# Altium schematic sheet lighthouse_sensor.SchDoc: Vive Lighthouse Sensor
size B; PageSetup: Record=PageOptions|CenterHorizontal=True|CenterVertical=True|PrintScale=0.25|XCorrection=1.00|YCorrection=1.00|PrintKind=0|BorderSize=5000000|LeftOffset=0|BottomOffset=0|Orientation=2|PaperLength=1000|PaperWidth=1000|Scale=100|PaperSource=7|PrintQuality=-3|MediaType=1|DitherType=10|PrintScaleMode=1|PaperKind=Letter|PaperIndex=1
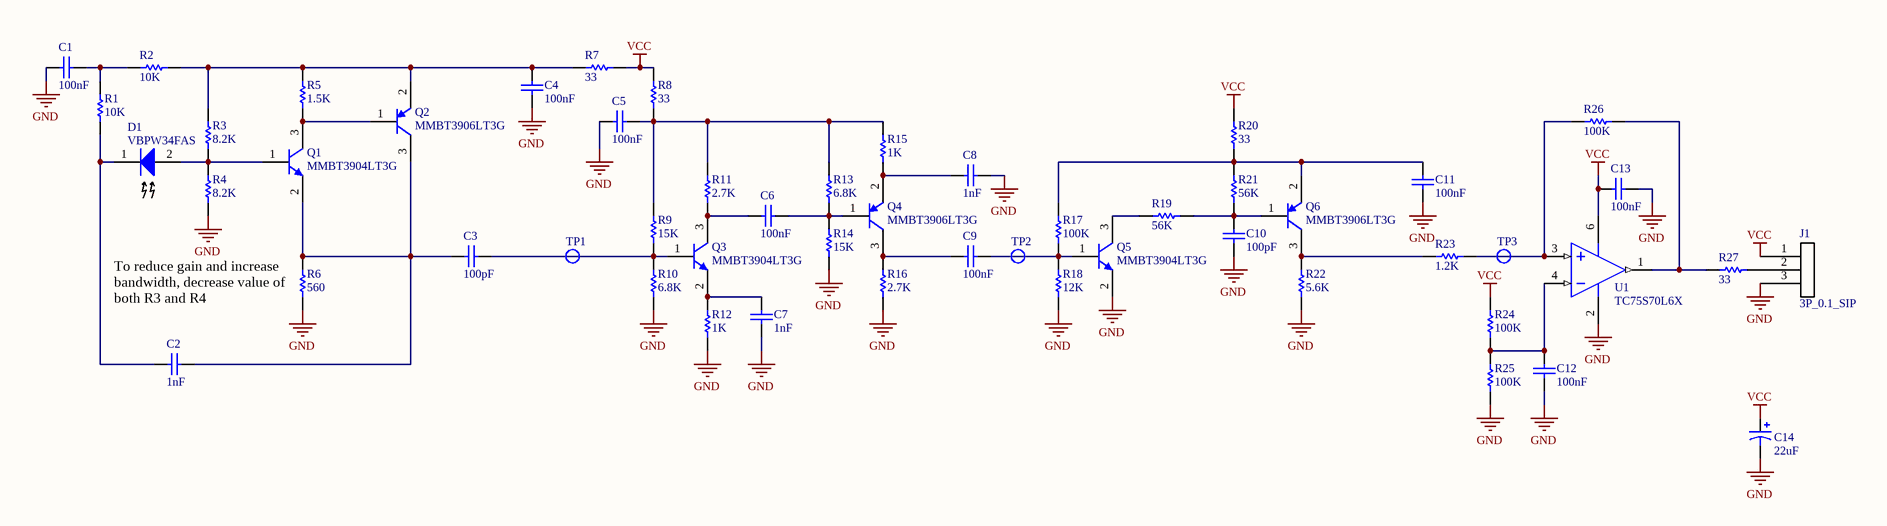
[diagram p0: lighthouse_sensor.SchDoc]

## Parts
C1  value 100nF  [0603]  (hidden comment: C0603)
C2  value 1nF  [0603]  (hidden comment: C0603)
C3  value 100pF  [0603]  (hidden comment: C0603)
C4  value 100nF  [0603]  (hidden comment: C0603)
C5  value 100nF  [0603]  (hidden comment: C0603)
C6  value 100nF  [0603]  (hidden comment: C0603)
C7  value 1nF  [0603]  (hidden comment: C0603)
C8  value 1nF  [0603]  (hidden comment: C0603)
C9  value 100nF  [0603]  (hidden comment: C0603)
C10  value 100pF  [0603]  (hidden comment: C0603)
C11  value 100nF  [0603]  (hidden comment: C0603)
C12  value 100nF  [0603]  (hidden comment: C0603)
C13  value 100nF  [0603]  (hidden comment: C0603)
C14  value 22uF  [Capacitor]  (hidden comment: Electrolytic Capacitor)
D1  VBPW34FAS  [VBPW34FAS]
J1  3P_0.1_SIP  [3P_0.1_SIP]
Q1  MMBT3904LT3G  [ONSC-SOT-23-3-318-08_V]
Q2  MMBT3906LT3G  [ONSC-SOT-23-3-318-08_V]
Q3  MMBT3904LT3G  [ONSC-SOT-23-3-318-08_V]
Q4  MMBT3906LT3G  [ONSC-SOT-23-3-318-08_V]
Q5  MMBT3904LT3G  [ONSC-SOT-23-3-318-08_V]
Q6  MMBT3906LT3G  [ONSC-SOT-23-3-318-08_V]
R1  10K  [3-0603]
R2  10K  [3-0603]
R3  8.2K  [3-0603]
R4  8.2K  [3-0603]
R5  1.5K  [3-0603]
R6  560  [3-0603]
R7  33  [3-0603]
R8  33  [3-0603]
R9  15K  [3-0603]
R10  6.8K  [3-0603]
R11  2.7K  [3-0603]
R12  1K  [3-0603]
R13  6.8K  [3-0603]
R14  15K  [3-0603]
R15  1K  [3-0603]
R16  2.7K  [3-0603]
R17  100K  [3-0603]
R18  12K  [3-0603]
R19  56K  [3-0603]
R20  33  [3-0603]
R21  56K  [3-0603]
R22  5.6K  [3-0603]
R23  1.2K  [3-0603]
R24  100K  [3-0603]
R25  100K  [3-0603]
R26  100K  [3-0603]
R27  33  [3-0603]
U1  TC75S70L6X  [MP6C]

## Nets
GND: C1.2 C4.2 C5.2 C7.2 C8.1 C10.2 C11.2 C12.2 C13.1 C14.2 J1.3 Q5.2(E) R4.1 R6.1 R10.1 R12.1 R14.1 R16.1 R18.1 R22.1 R25.1 U1.2(VSS)
VCC: C13.2 C14.1 J1.1 R7.1 R8.1 R20.1 R24.1 U1.6(VDD)
NetC1_1: C1.1 R1.2 R2.2
NetC2_1: C2.1 C3.2 Q1.2(E) Q2.3(C) R6.2
NetC2_2: C2.2 D1.1(K) R1.1
NetC3_1: C3.1 Q3.1(B) R9.2 R10.2
NetC4_1: C4.1 Q2.2(E) R2.1 R3.2 R5.2 R7.2
NetC5_1: C5.1 R8.2 R9.1 R11.1 R13.1 R15.1
NetC6_1: C6.1 Q4.1(B) R13.2 R14.2
NetC6_2: C6.2 Q3.3(C) R11.2
NetC7_1: C7.1 Q3.2(E) R12.2
NetC8_2: C8.2 Q4.2(E) R15.2
NetC9_1: C9.1 Q5.1(B) R17.2 R18.2
NetC9_2: C9.2 Q4.3(C) R16.2
NetC10_1: C10.1 Q6.1(B) R19.2 R21.2
NetC11_1: C11.1 Q6.2(E) R17.1 R20.2 R21.1
NetC12_1: C12.1 R24.2 R25.2 U1.4(-IN)
NetD1_2: D1.2(A) Q1.1(B) R3.1 R4.2
NetJ1_2: J1.2 R27.1
NetQ1_3: Q1.3(C) Q2.1(B) R5.1
NetQ5_3: Q5.3(C) R19.1
NetQ6_3: Q6.3(C) R22.2 R23.2
NetR23_1: R23.1 R26.2 U1.3(+IN)
NetR26_1: R26.1 R27.2 U1.1(OUT)

## Notes on the sheet
- TP1
- TP2
- (near R23) TP3
- (near R6) To reduce gain and increase bandwidth, decrease value of both R3 and R4

## Library data of the parts
C1-C13 = C0603: Ceramic Chip Capacitor - Standard; Note: Footprint corresponds to dimensions for bulk cassette packaging. This case size has tightened tolerances.; Published: 17-Jul-2002; LatestRevisionDate: 19-Mar-2004; LatestRevisionNote: Silkscreen size reduced.; DatasheetDocument: Mar-2001; PackageDocument: Mar-2001; PackageReference: 0603; Publisher: Altium Limited; Code_JEITA: 0603; Code_IPC: 1608 [0603]; ComponentLink1Description: Manufacturer Link; ComponentLink1URL: http://www.kemet.com/; ComponentLink2Description: Datasheet; ComponentLink2URL: http://www.kemet.com/kemet/web/homepage/kechome.nsf/vapubfilesname/F3102TA.pdf/$file/F3102TA.pdf
D1 = VBPW34FAS: Silicon PIN Photodiode
J1 = 3P_0.1_SIP: 1x3 0.1" PTH Header
Q1 Q3 Q5 = MMBT3904LT3G: General Purpose Transistor, NPN Silicon, 3-Pin SOT-23, Pb-Free, Tape and Reel; Manufacturer: On Semiconductor; fT Min (MHz): 300; IC Continuous (A): 0.2; DatasheetVersion: Rev. 12; PackageVersion: Rev. AP, 11/2009; PackageReference: SOT-23-3-318-08; PackageDescription: 3-Pin Small Outline Transistor, Body 2.92 x 1.3 mm, Pitch 0.95 mm; Supplier 1: Digi-Key; Supplier Part Number 1: MMBT3904LT3GOSTR-ND; Supplier 2: Digi-Key; Supplier Part Number 2: MMBT3904LT3GOSCT-ND; Supplier 3: Digi-Key; Supplier Part Number 3: MMBT3904LT3GOSDKR-ND; Supplier 4: Farnell; Supplier Part Number 4: 1287979; Supplier 5: Newark; Supplier Part Number 5: 98H0751; Supplier 6: Mouser; Supplier Part Number 6: 863-MMBT3904LT3G; Packing: Tape and Reel; Polarity: NPN; RoHS: TRUE; Mounting Technology: Surface Mount; PartNumber: MMBT3904LT3G; ComponentLink1Description: Manufacturer URL; ComponentLink1URL: http://www.onsemi.com/; ComponentLink2Description: Datasheet; ComponentLink2URL: http://www.onsemi.cn/pub_link/Collateral/MMBT3904LT1-D.PDF; ComponentLink3Description: Package Specification; ComponentLink3URL: http://www.onsemi.cn/pub_link/Collateral/318-08.PDF
Q2 Q4 Q6 = MMBT3906LT3G: General Purpose Transistor, PNP Silicon, 3-Pin SOT-23, Pb-Free, Tape and Reel; Manufacturer: On Semiconductor; fT Min (MHz): 250; IC Continuous (A): -0.2; DatasheetVersion: Rev. 11; PackageVersion: Rev. AP, 11/2009; PackageReference: SOT-23-3-318-08; PackageDescription: 3-Pin Small Outline Transistor, Body 2.92 x 1.3 mm, Pitch 0.95 mm; Supplier 1: Digi-Key; Supplier Part Number 1: MMBT3906LT3GOSTR-ND; Supplier 2: Digi-Key; Supplier Part Number 2: MMBT3906LT3GOSCT-ND; Supplier 3: Digi-Key; Supplier Part Number 3: MMBT3906LT3GOSDKR-ND; Supplier 4: Farnell; Supplier Part Number 4: 1887082; Supplier 5: Farnell; Supplier Part Number 5: 2372923; Supplier 6: Newark; Supplier Part Number 6: 98H0752; Supplier 7: Newark; Supplier Part Number 7: 09R9450; Supplier 8: Mouser; Supplier Part Number 8: 863-MMBT3906LT3G; Packing: Tape and Reel; Polarity: PNP; RoHS: TRUE; Mounting Technology: Surface Mount; PartNumber: MMBT3906LT3G; ComponentLink1Description: Manufacturer URL; ComponentLink1URL: http://www.onsemi.com/; ComponentLink2Description: Datasheet; ComponentLink2URL: http://www.onsemi.cn/pub_link/Collateral/MMBT3906LT1-D.PDF; ComponentLink3Description: Package Specification; ComponentLink3URL: http://www.onsemi.cn/pub_link/Collateral/318-08.PDF
R1-R27 = ERJ3EK: Precision Thick Film Chip Resistor, 10 Ohm to 1M Ohm Range, 1% and 0.5% Tolerance, 0603 Size, 0.063 W; Published: 17-Dec-2003; LatestRevisionDate: 19-Mar-2004; LatestRevisionNote: Silkscreen size reduced.; PackageDocument: Mar-2003; PackageReference: 3-0603; Publisher: Altium Limited; Code_IPC: 1608 [0603]; ComponentLink1Description: Manufacturer Link; ComponentLink1URL: http://www.panasonic.com/industrial/components/resistive_products.htm; ComponentLink2Description: Datasheet; ComponentLink2URL: http://www.panasonic.com/industrial/components/pdf/AOA0000CE2.pdf
U1 = TC75S70L6X: Single Comparator